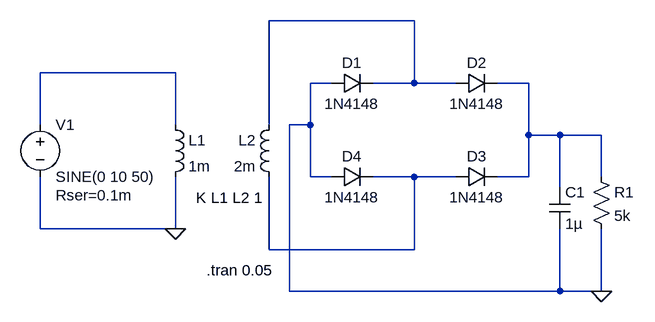
[diagram p0: schematic fullwaverectifier.asc]
fullwaverectifier.asc, the LTspice schematic file:
Version 4.1
SHEET 1 880 680
WIRE 288 16 64 16
WIRE -80 96 -288 96
WIRE 160 112 128 112
WIRE 288 112 288 16
WIRE 288 112 224 112
WIRE 352 112 288 112
WIRE 464 112 416 112
WIRE -288 176 -288 96
WIRE -80 176 -80 96
WIRE 64 176 64 16
WIRE 128 176 128 112
WIRE 128 176 96 176
WIRE 464 192 464 112
WIRE 512 192 464 192
WIRE 576 192 512 192
WIRE 128 256 128 176
WIRE 160 256 128 256
WIRE 288 256 224 256
WIRE 352 256 288 256
WIRE 464 256 464 192
WIRE 464 256 416 256
WIRE 576 256 576 192
WIRE 512 272 512 192
WIRE -288 336 -288 256
WIRE -80 336 -80 256
WIRE -80 336 -288 336
WIRE 64 368 64 256
WIRE 288 368 288 256
WIRE 288 368 64 368
WIRE 96 432 96 176
WIRE 512 432 512 336
WIRE 512 432 96 432
WIRE 576 432 576 336
WIRE 576 432 512 432
FLAG -80 336 0
FLAG 576 432 0
SYMBOL diode 160 96 M90
WINDOW 0 0 32 VBottom 2
WINDOW 3 32 32 VTop 2
SYMATTR InstName D1
SYMATTR Value 1N4148
SYMBOL diode 352 96 M90
WINDOW 0 0 32 VBottom 2
WINDOW 3 32 32 VTop 2
SYMATTR InstName D2
SYMATTR Value 1N4148
SYMBOL diode 352 240 M90
WINDOW 0 0 32 VBottom 2
WINDOW 3 32 32 VTop 2
SYMATTR InstName D3
SYMATTR Value 1N4148
SYMBOL diode 160 240 M90
WINDOW 0 0 32 VBottom 2
WINDOW 3 32 32 VTop 2
SYMATTR InstName D4
SYMATTR Value 1N4148
SYMBOL ind -96 160 R0
SYMATTR InstName L1
SYMATTR Value 1m
SYMATTR Type ind
SYMATTR SpiceLine Rser=1m
SYMBOL ind 80 160 M0
SYMATTR InstName L2
SYMATTR Value 2m
SYMATTR Type ind
SYMATTR SpiceLine Rser=1m
SYMBOL res 560 240 R0
SYMATTR InstName R1
SYMATTR Value 5k
SYMBOL voltage -288 160 R0
WINDOW 123 0 0 Left 0
WINDOW 39 24 124 Left 2
SYMATTR InstName V1
SYMATTR Value SINE(0 10 50)
SYMATTR SpiceLine Rser=0.1m
SYMBOL cap 496 272 R0
SYMATTR InstName C1
SYMATTR Value 1µ
TEXT -48 288 Left 2 !K L1 L2 1
TEXT -32 400 Left 2 !.tran 0.05

The netlist it stands for:
* fullwaverectifier.asc
D1 0 N001 1N4148
D2 N001 N003 1N4148
D3 N004 N003 1N4148
D4 0 N004 1N4148
L1 N002 0 1m Rser=1m
L2 N001 N004 2m Rser=1m
R1 N003 0 5k
V1 N002 0 SINE(0 10 50) Rser=0.1m
C1 N003 0 1µ
.model D D
.lib standard.dio
K L1 L2 1
.tran 0.05
.backanno
.end